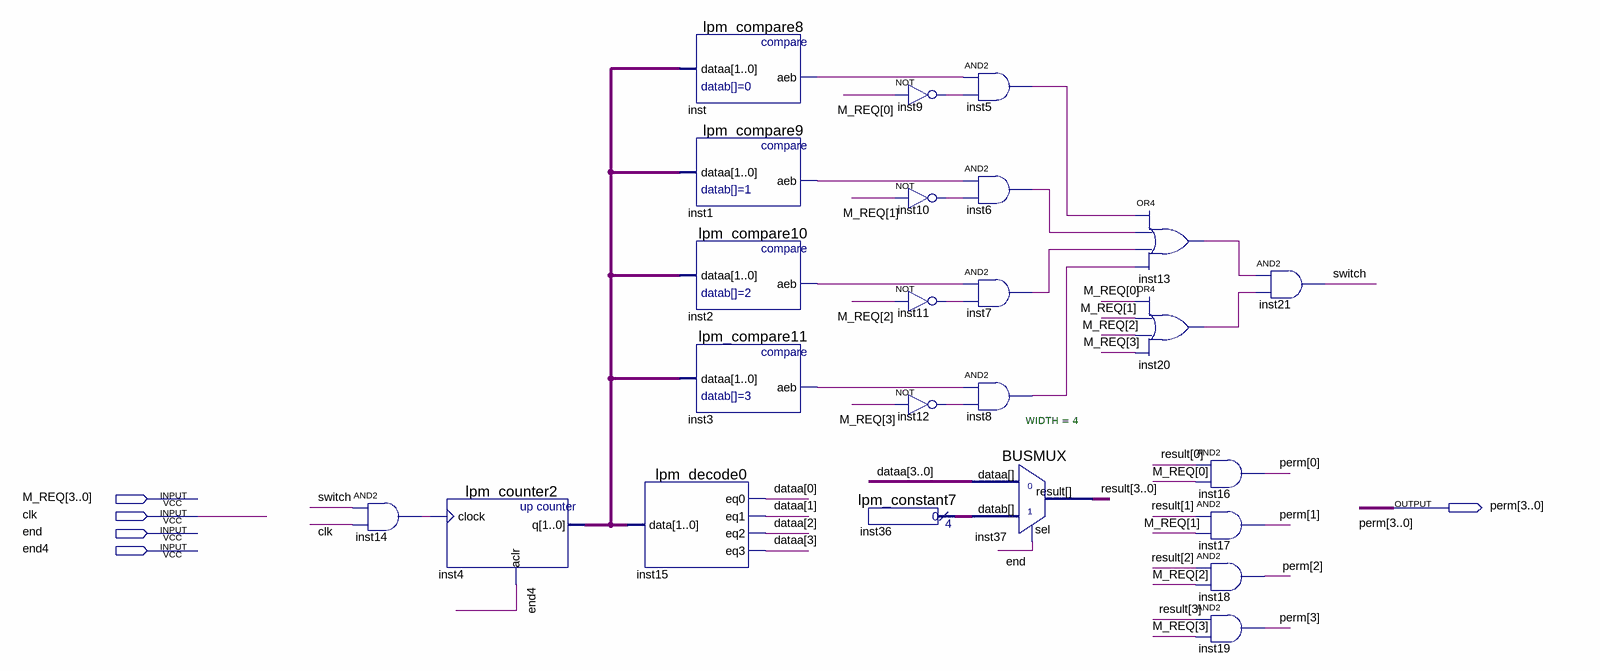
[diagram p0: schematic sheet]
// Quartus schematic Arbiter2.bdf as structural Verilog: 24 symbols, 5 pins
module Arbiter2 (
  input  [3:0] M_REQ,
  input  clk,
  input  \end ,
  input  end4,
  output [3:0] perm
);

  wire inst1_aeb, inst2_aeb, inst3_aeb, inst5_out, inst6_out, inst7_out, inst8_out, inst9_out, inst10_out,
       inst11_out, inst12_out, inst13_out, inst14_out, inst20_out, inst_aeb, switch;
  wire [1:0] inst4_q;
  wire [3:0] dataa, inst36_result, result;

  and inst14 (inst14_out, switch, clk);
  lpm_counter2 inst4 (.clock(inst14_out), .aclr(end4), .q(inst4_q));
  lpm_decode0 inst15 (.data(inst4_q), .eq0(dataa[0]), .eq1(dataa[1]), .eq2(dataa[2]), .eq3(dataa[3]));
  lpm_compare8 inst (.dataa(inst4_q), .aeb(inst_aeb));
  lpm_compare9 inst1 (.dataa(inst4_q), .aeb(inst1_aeb));
  lpm_compare10 inst2 (.dataa(inst4_q), .aeb(inst2_aeb));
  lpm_compare11 inst3 (.dataa(inst4_q), .aeb(inst3_aeb));
  lpm_constant7 inst36 (.result(inst36_result));
  not inst9 (inst9_out, M_REQ[0]);
  not inst10 (inst10_out, M_REQ[1]);
  not inst11 (inst11_out, M_REQ[2]);
  not inst12 (inst12_out, M_REQ[3]);
  and inst5 (inst5_out, inst_aeb, inst9_out);
  and inst6 (inst6_out, inst1_aeb, inst10_out);
  and inst7 (inst7_out, inst2_aeb, inst11_out);
  and inst8 (inst8_out, inst3_aeb, inst12_out);
  BUSMUX #(.WIDTH(4)) inst37 (.datab(inst36_result), .sel(\end ), .dataa(dataa), .result(result));
  or inst13 (inst13_out, inst5_out, inst6_out, inst7_out, inst8_out);
  or inst20 (inst20_out, M_REQ[0], M_REQ[1], M_REQ[2], M_REQ[3]);
  and inst16 (perm[0], result[0], M_REQ[0]);
  and inst17 (perm[1], result[1], M_REQ[1]);
  and inst18 (perm[2], result[2], M_REQ[2]);
  and inst19 (perm[3], result[3], M_REQ[3]);
  and inst21 (switch, inst13_out, inst20_out);
endmodule
